# Altium schematic sheet IO_robot.SchDoc
size A0; Organization: Altium Limited; Address1: L3, 12a Rodborough Rd; Address2: Frenchs Forest; Address3: NSW; Address4: Australia 2086
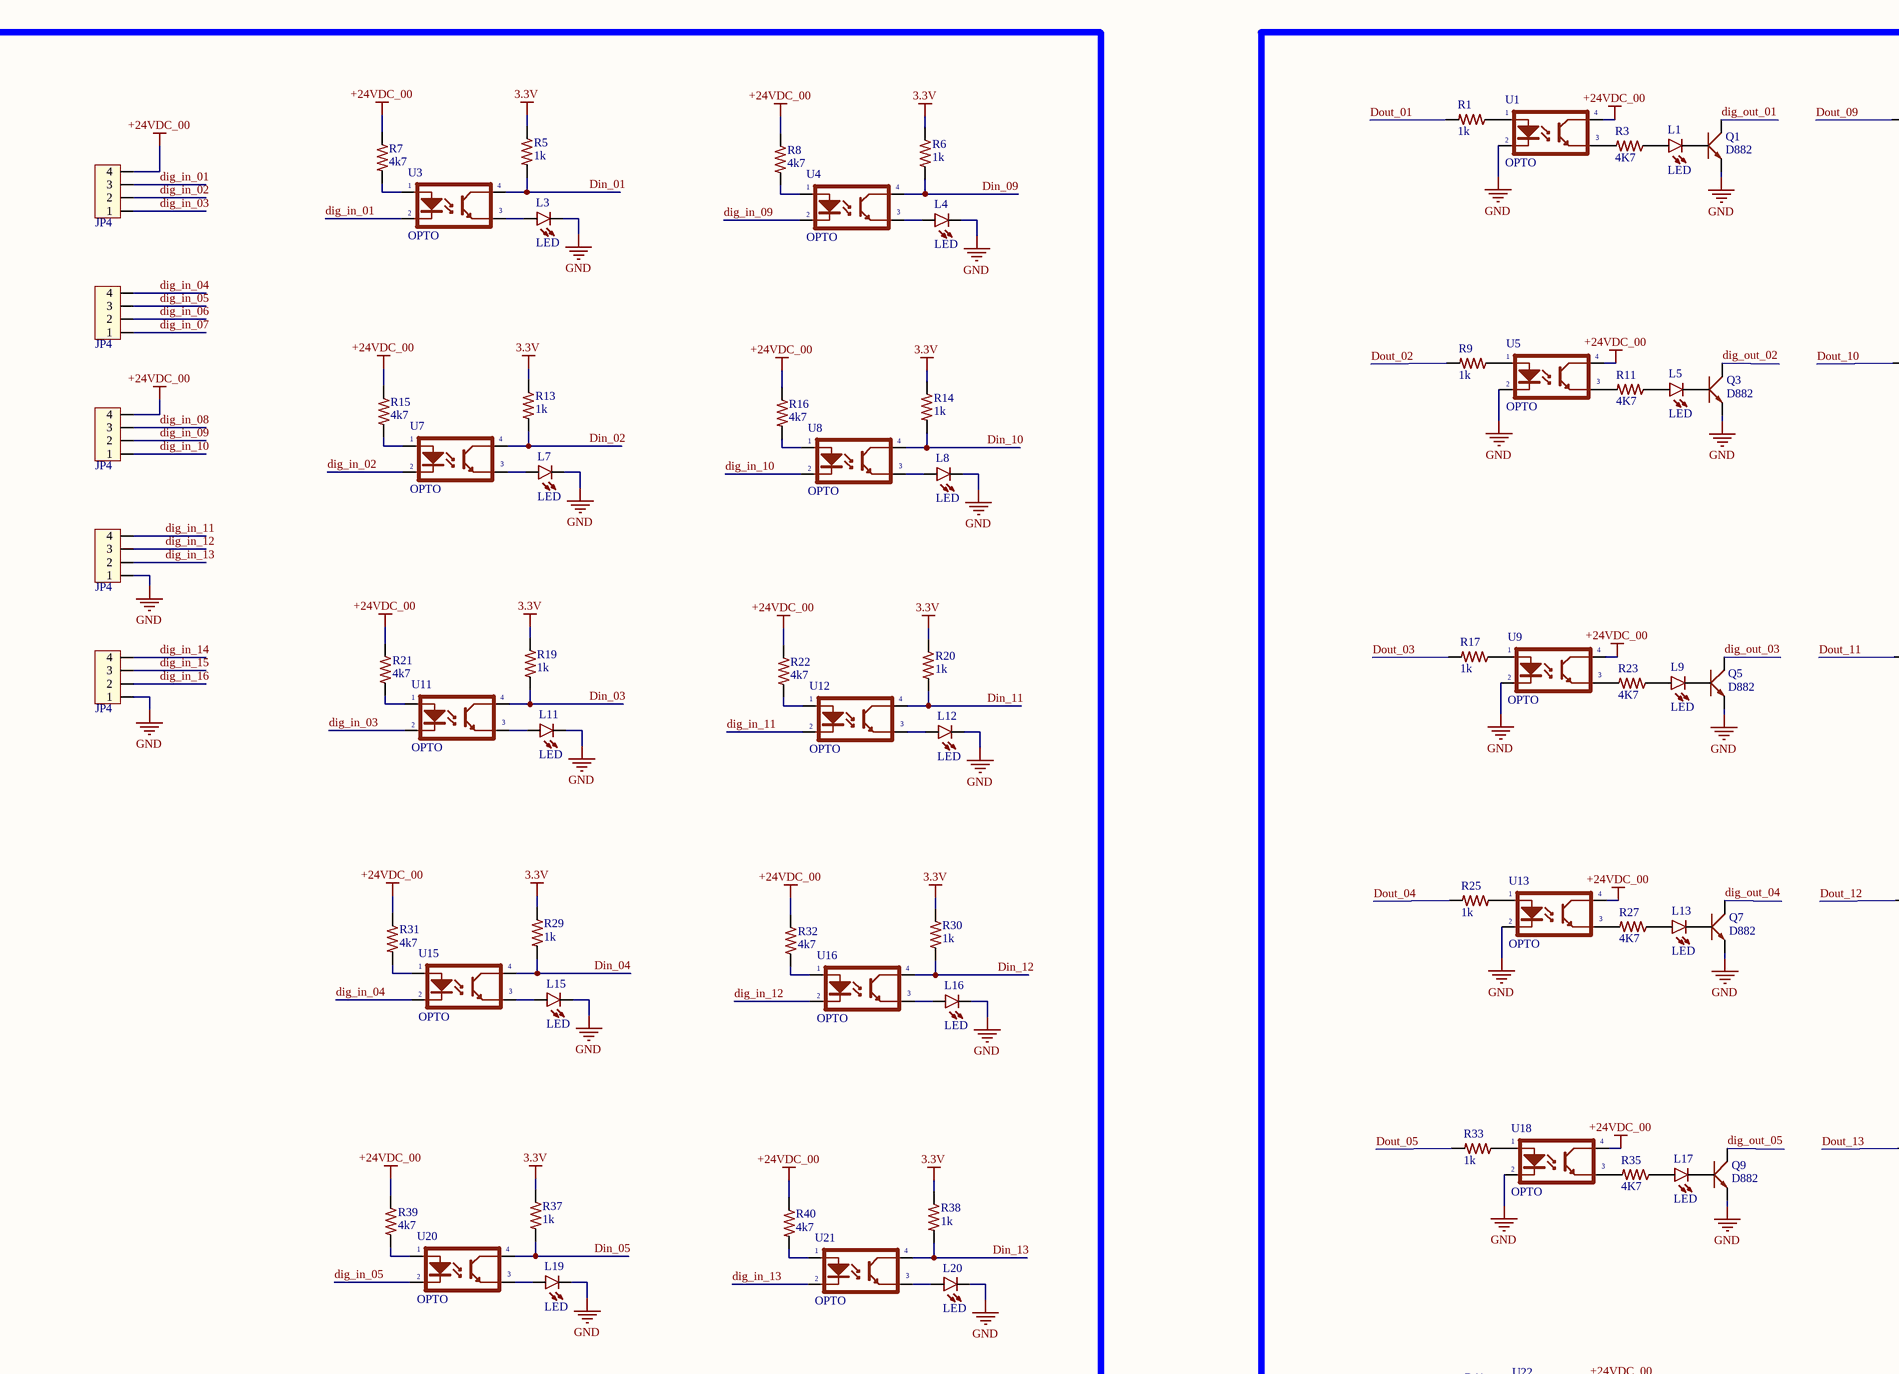
[diagram p0: IO_robot.SchDoc, top left]
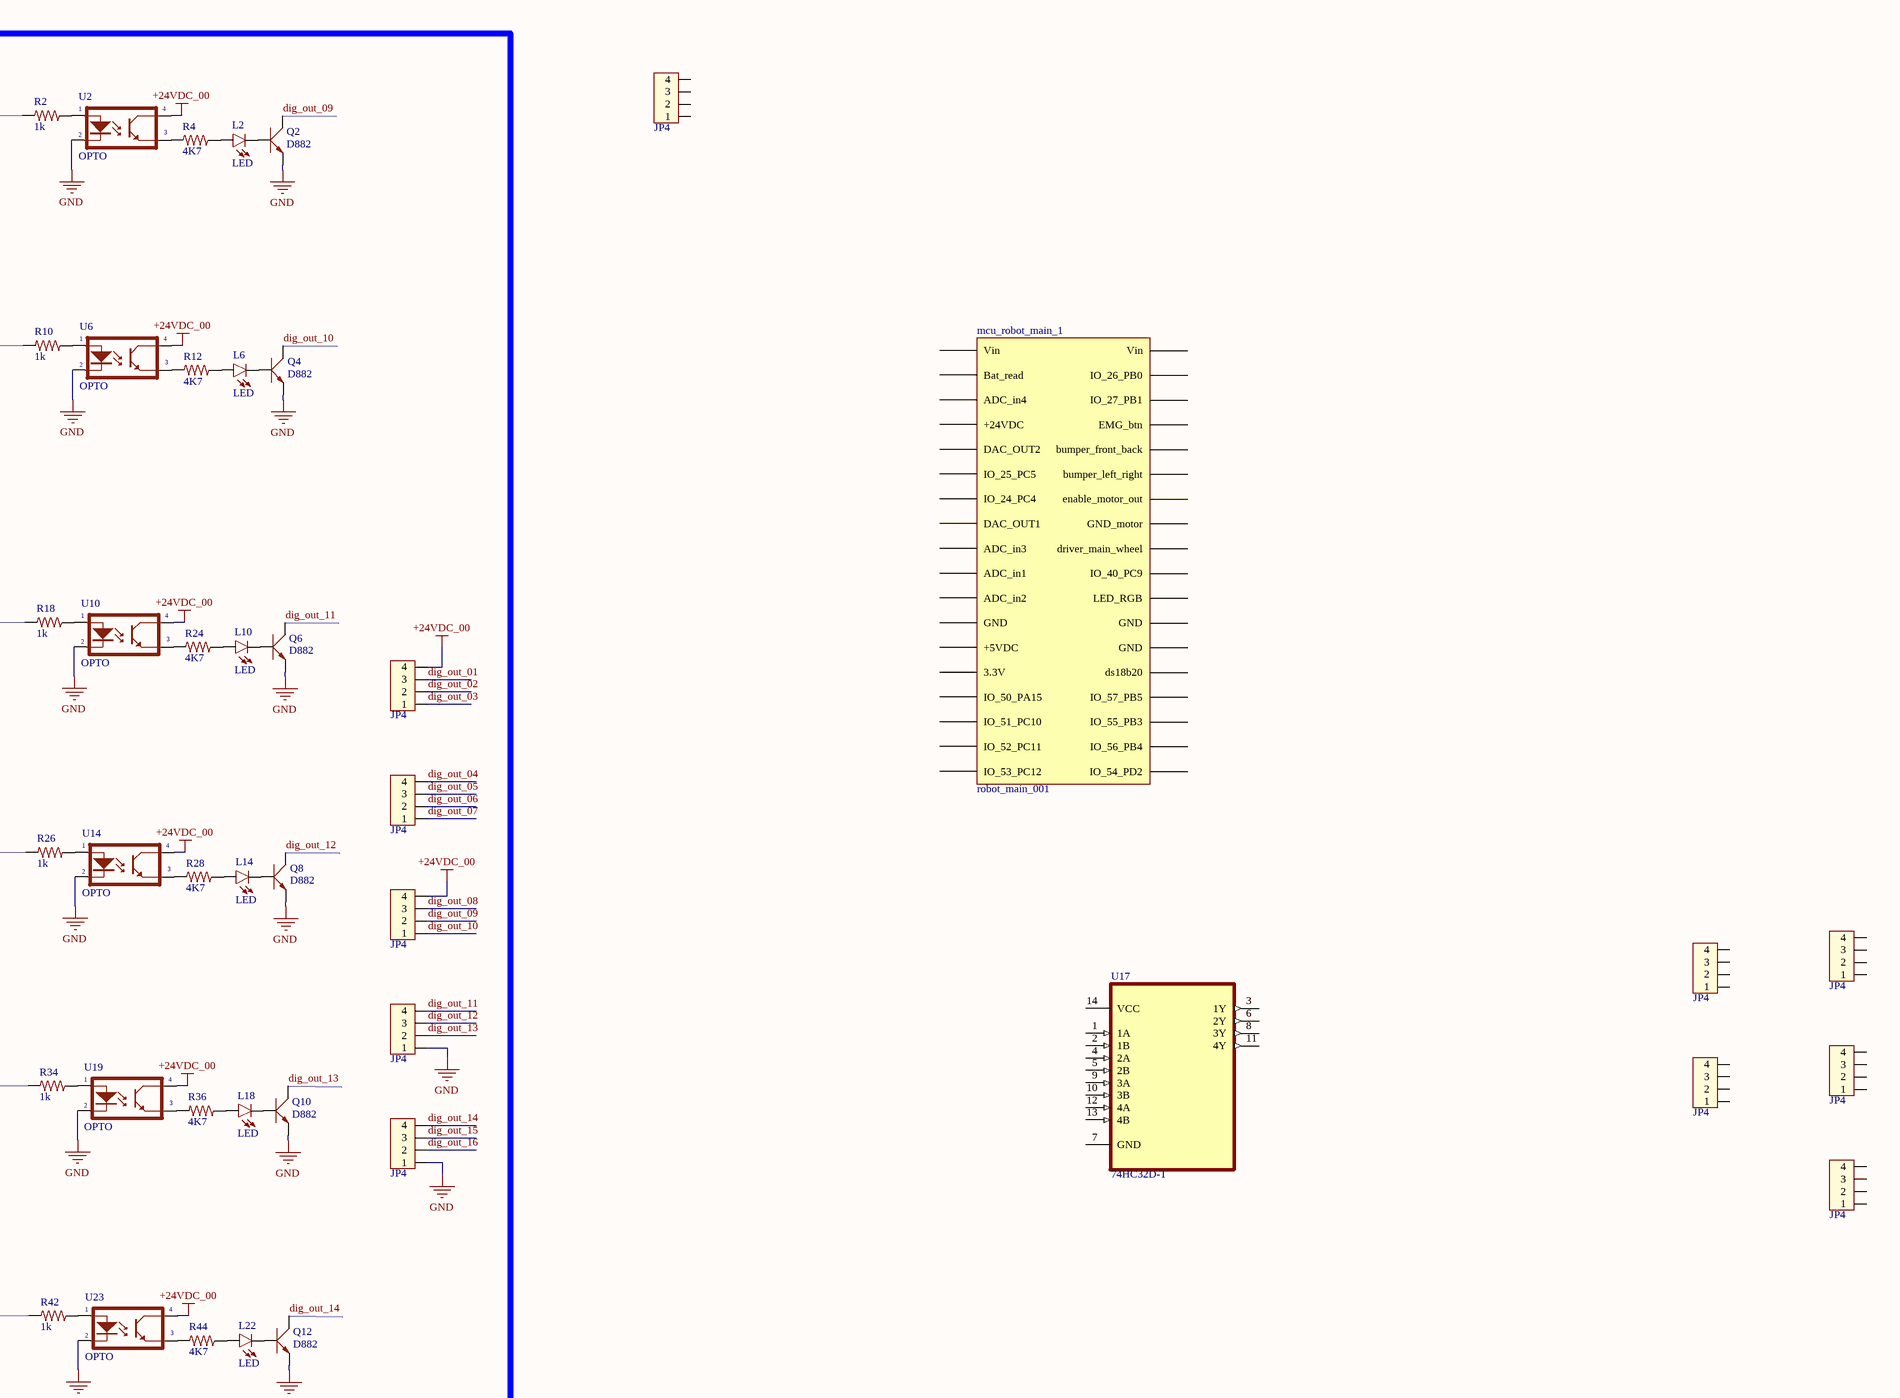
[diagram p1: IO_robot.SchDoc, top right]
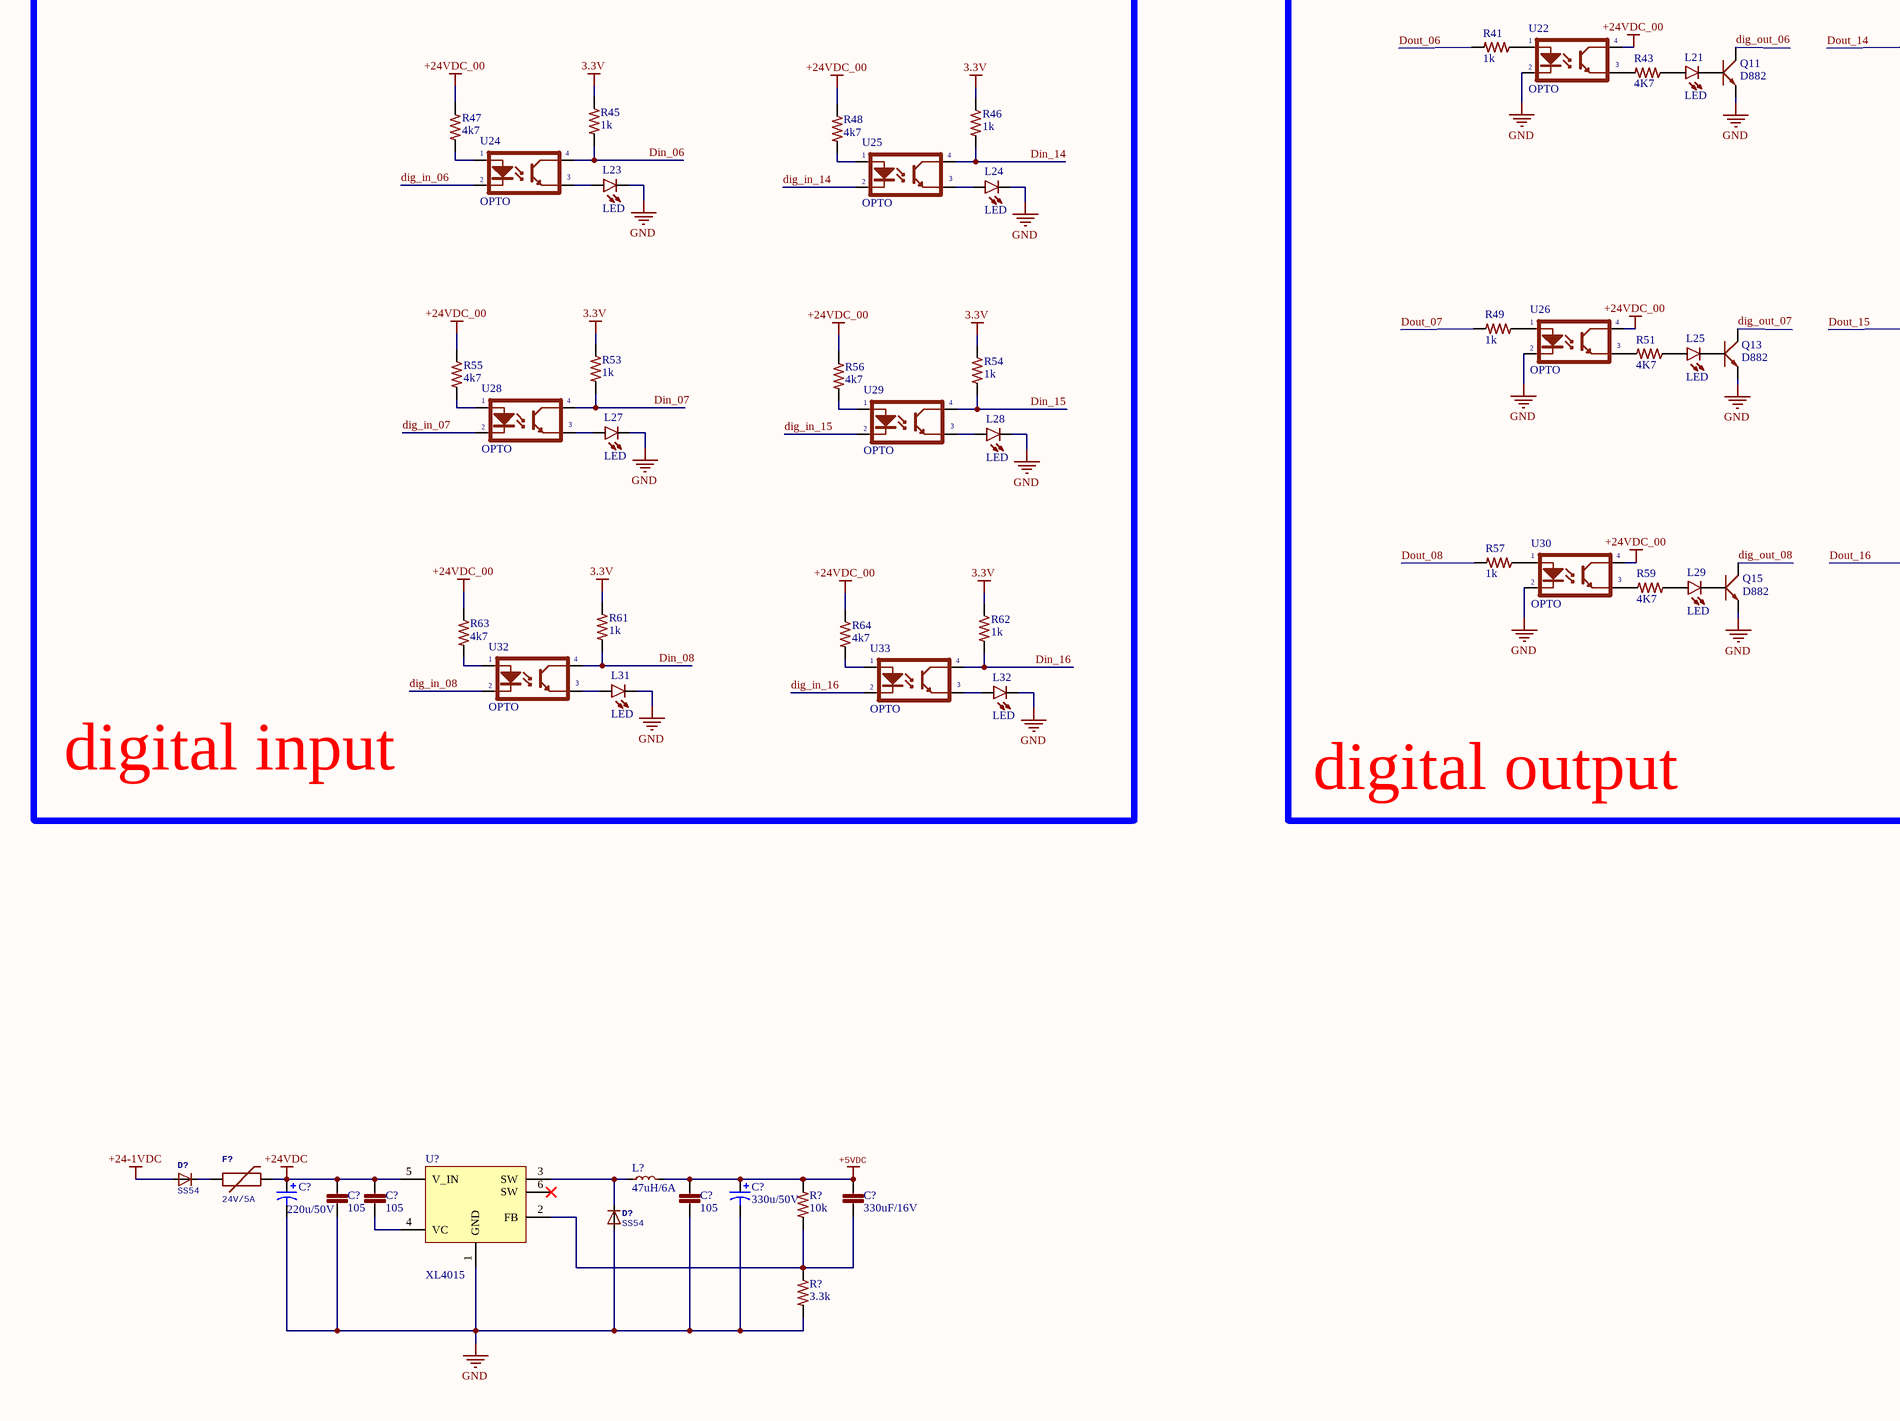
[diagram p2: IO_robot.SchDoc, bottom left]
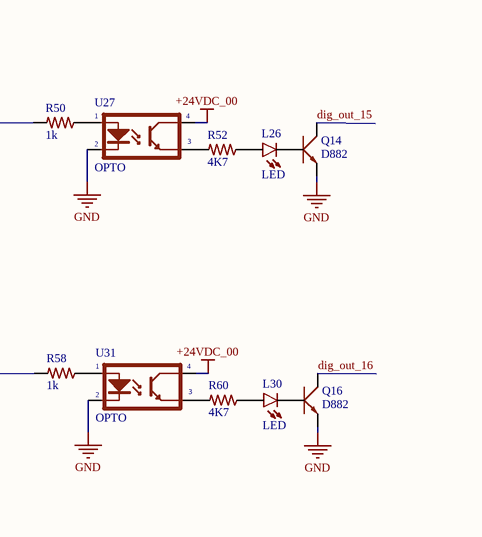
[diagram p3: IO_robot.SchDoc, bottom right]

## Parts
(Parts that share a designator on the sheet are numbered #1, #2 ... from top to bottom, then left to right.)
C?#1  220u/50V  [CAP_SMD_8x10]
C?#2  105  [CAP_SMD0603]
C?#3  105  [CAP_SMD0603]
C?#4  105  [CAP_SMD0603]
C?#5  330u/50V  [CAP_SMD_8x10]
C?#6  330uF/16V  [CAP_SMD0603]
D?#1  SS54  [SMB]
D?#2  SS54  [SMB]
F?  24V/5A  [1206]
JP1  JP4  [CON4]
JP2  JP4  [CON4]
JP3  JP4  [CON4]
JP4  JP4  [CON4]
JP5  JP4  [CON4]
JP6  JP4  [CON4]
JP7  JP4  [CON4]
JP8  JP4  [CON4]
JP9  JP4  [CON4]
JP10  JP4  [CON4]
JP11  JP4  [CON4]
JP12  JP4  [CON4]
JP13  JP4  [CON4]
JP14  JP4  [CON4]
JP15  JP4  [CON4]
JP16  JP4  [CON4]
L1  LED  [LED_GREEN_SMD_0603]
L2  LED  [LED_GREEN_SMD_0603]
L3  LED  [LED_RED_SMD_0603]
L4  LED  [LED_RED_SMD_0603]
L5  LED  [LED_GREEN_SMD_0603]
L6  LED  [LED_GREEN_SMD_0603]
L7  LED  [LED_RED_SMD_0603]
L8  LED  [LED_RED_SMD_0603]
L9  LED  [LED_GREEN_SMD_0603]
L10  LED  [LED_GREEN_SMD_0603]
L11  LED  [LED_RED_SMD_0603]
L12  LED  [LED_RED_SMD_0603]
L13  LED  [LED_GREEN_SMD_0603]
L14  LED  [LED_GREEN_SMD_0603]
L15  LED  [LED_RED_SMD_0603]
L16  LED  [LED_RED_SMD_0603]
L17  LED  [LED_GREEN_SMD_0603]
L18  LED  [LED_GREEN_SMD_0603]
L19  LED  [LED_RED_SMD_0603]
L20  LED  [LED_RED_SMD_0603]
L21  LED  [LED_GREEN_SMD_0603]
L22  LED  [LED_GREEN_SMD_0603]
L23  LED  [LED_RED_SMD_0603]
L24  LED  [LED_RED_SMD_0603]
L25  LED  [LED_GREEN_SMD_0603]
L26  LED  [LED_GREEN_SMD_0603]
L27  LED  [LED_RED_SMD_0603]
L28  LED  [LED_RED_SMD_0603]
L29  LED  [LED_GREEN_SMD_0603]
L30  LED  [LED_GREEN_SMD_0603]
L31  LED  [LED_RED_SMD_0603]
L32  LED  [LED_RED_SMD_0603]
L?  47uH/6A  [Inductor_47uH_6A]
mcu_robot_main_1  robot_main_001  [robot_main_001]
Q1  D882  [SOT89]
Q2  D882  [SOT89]
Q3  D882  [SOT89]
Q4  D882  [SOT89]
Q5  D882  [SOT89]
Q6  D882  [SOT89]
Q7  D882  [SOT89]
Q8  D882  [SOT89]
Q9  D882  [SOT89]
Q10  D882  [SOT89]
Q11  D882  [SOT89]
Q12  D882  [SOT89]
Q13  D882  [SOT89]
Q14  D882  [SOT89]
Q15  D882  [SOT89]
Q16  D882  [SOT89]
R1  1k  [RES_SMD0603]
R2  1k  [RES_SMD0603]
R3  4K7  [RES_SMD0603]
R4  4K7  [RES_SMD0603]
R5  1k  [RES_SMD0603]
R6  1k  [RES_SMD0603]
R7  4k7  [RES_SMD0603]
R8  4k7  [RES_SMD0603]
R9  1k  [RES_SMD0603]
R10  1k  [RES_SMD0603]
R11  4K7  [RES_SMD0603]
R12  4K7  [RES_SMD0603]
R13  1k  [RES_SMD0603]
R14  1k  [RES_SMD0603]
R15  4k7  [RES_SMD0603]
R16  4k7  [RES_SMD0603]
R17  1k  [RES_SMD0603]
R18  1k  [RES_SMD0603]
R19  1k  [RES_SMD0603]
R20  1k  [RES_SMD0603]
R21  4k7  [RES_SMD0603]
R22  4k7  [RES_SMD0603]
R23  4K7  [RES_SMD0603]
R24  4K7  [RES_SMD0603]
R25  1k  [RES_SMD0603]
R26  1k  [RES_SMD0603]
R27  4K7  [RES_SMD0603]
R28  4K7  [RES_SMD0603]
R29  1k  [RES_SMD0603]
R30  1k  [RES_SMD0603]
R31  4k7  [RES_SMD0603]
R32  4k7  [RES_SMD0603]
R33  1k  [RES_SMD0603]
R34  1k  [RES_SMD0603]
R35  4K7  [RES_SMD0603]
R36  4K7  [RES_SMD0603]
R37  1k  [RES_SMD0603]
R38  1k  [RES_SMD0603]
R39  4k7  [RES_SMD0603]
R40  4k7  [RES_SMD0603]
R41  1k  [RES_SMD0603]
R42  1k  [RES_SMD0603]
R43  4K7  [RES_SMD0603]
R44  4K7  [RES_SMD0603]
R45  1k  [RES_SMD0603]
R46  1k  [RES_SMD0603]
R47  4k7  [RES_SMD0603]
R48  4k7  [RES_SMD0603]
R49  1k  [RES_SMD0603]
R50  1k  [RES_SMD0603]
R51  4K7  [RES_SMD0603]
R52  4K7  [RES_SMD0603]
R53  1k  [RES_SMD0603]
R54  1k  [RES_SMD0603]
R55  4k7  [RES_SMD0603]
R56  4k7  [RES_SMD0603]
R57  1k  [RES_SMD0603]
R58  1k  [RES_SMD0603]
R59  4K7  [RES_SMD0603]
R60  4K7  [RES_SMD0603]
R61  1k  [RES_SMD0603]
R62  1k  [RES_SMD0603]
R63  4k7  [RES_SMD0603]
R64  4k7  [RES_SMD0603]
R?#1  10k  [RES_SMD0603]
R?#2  3.3k  [RES_SMD0603]
U1  OPTO  [SOP4]
U2  OPTO  [SOP4]
U3  OPTO  [SOP4]
U4  OPTO  [SOP4]
U5  OPTO  [SOP4]
U6  OPTO  [SOP4]
U7  OPTO  [SOP4]
U8  OPTO  [SOP4]
U9  OPTO  [SOP4]
U10  OPTO  [SOP4]
U11  OPTO  [SOP4]
U12  OPTO  [SOP4]
U13  OPTO  [SOP4]
U14  OPTO  [SOP4]
U15  OPTO  [SOP4]
U16  OPTO  [SOP4]
U17  74HC32D-T  [SOIC127P600X175-14N]
U18  OPTO  [SOP4]
U19  OPTO  [SOP4]
U20  OPTO  [SOP4]
U21  OPTO  [SOP4]
U22  OPTO  [SOP4]
U23  OPTO  [SOP4]
U24  OPTO  [SOP4]
U25  OPTO  [SOP4]
U26  OPTO  [SOP4]
U27  OPTO  [SOP4]
U28  OPTO  [SOP4]
U29  OPTO  [SOP4]
U30  OPTO  [SOP4]
U31  OPTO  [SOP4]
U32  OPTO  [SOP4]
U33  OPTO  [SOP4]
U?  XL4015  [TO-263-5]

## Nets
3.3V: R5.1 R6.1 R13.1 R14.1 R19.1 R20.1 R29.1 R30.1 R37.1 R38.1 R45.1 R46.1 R53.1 R54.1 R61.1 R62.1
+5VDC: C?#4.1 C?#5.1 C?#6.1 L?.2 R?#1.1
+24-1VDC: D?#1.1
+24VDC: C?#1.1 C?#2.1 C?#3.1 F?.2 U?.5(V_IN)
+24VDC_00: JP1.4 JP3.4 JP6.4 JP9.4 R7.1 R8.1 R15.1 R16.1 R21.1 R22.1 R31.1 R32.1 R39.1 R40.1 R47.1 R48.1 R55.1 R56.1 R63.1 R64.1 U1.4(C) U2.4(C) U5.4(C) U6.4(C) U9.4(C) U10.4(C) U13.4(C) U14.4(C) U18.4(C) U19.4(C) U22.4(C) U23.4(C) U26.4(C) U27.4(C) U30.4(C) U31.4(C)
GND: C?#1.2 C?#2.2 C?#4.2 C?#5.2 D?#2.1 JP4.1 JP5.1 JP12.1 JP15.1 L3.2(POS) L4.2(POS) L7.2(POS) L8.2(POS) L11.2(POS) L12.2(POS) L15.2(POS) L16.2(POS) L19.2(POS) L20.2(POS) L23.2(POS) L24.2(POS) L27.2(POS) L28.2(POS) L31.2(POS) L32.2(POS) Q1.2(EMITTER) Q2.2(EMITTER) Q3.2(EMITTER) Q4.2(EMITTER) Q5.2(EMITTER) Q6.2(EMITTER) Q7.2(EMITTER) Q8.2(EMITTER) Q9.2(EMITTER) Q10.2(EMITTER) Q11.2(EMITTER) Q12.2(EMITTER) Q13.2(EMITTER) Q14.2(EMITTER) Q15.2(EMITTER) Q16.2(EMITTER) R?#2.2 U1.2(K) U2.2(K) U5.2(K) U6.2(K) U9.2(K) U10.2(K) U13.2(K) U14.2(K) U18.2(K) U19.2(K) U22.2(K) U23.2(K) U26.2(K) U27.2(K) U30.2(K) U31.2(K) U?.1(GND)
dig_in_01: JP1.3 U3.2(K)
dig_in_02: JP1.2 U7.2(K)
dig_in_03: JP1.1 U11.2(K)
dig_in_04: JP2.4 U15.2(K)
dig_in_05: JP2.3 U20.2(K)
dig_in_06: JP2.2 U24.2(K)
dig_in_07: JP2.1 U28.2(K)
dig_in_08: JP3.3 U32.2(K)
dig_in_09: JP3.2 U4.2(K)
dig_in_10: JP3.1 U8.2(K)
dig_in_11: JP4.4 U12.2(K)
dig_in_12: JP4.3 U16.2(K)
dig_in_13: JP4.2 U21.2(K)
dig_in_14: JP5.4 U25.2(K)
dig_in_15: JP5.3 U29.2(K)
dig_in_16: JP5.2 U33.2(K)
dig_out_01: JP6.3 Q1.3(COLLECTOR)
dig_out_02: JP6.2 Q3.3(COLLECTOR)
dig_out_03: JP6.1 Q5.3(COLLECTOR)
dig_out_04: JP7.4 Q7.3(COLLECTOR)
dig_out_05: JP7.3 Q9.3(COLLECTOR)
dig_out_06: JP7.2 Q11.3(COLLECTOR)
dig_out_07: JP7.1 Q13.3(COLLECTOR)
dig_out_08: JP9.3 Q15.3(COLLECTOR)
dig_out_09: JP9.2 Q2.3(COLLECTOR)
dig_out_10: JP9.1 Q4.3(COLLECTOR)
dig_out_11: JP12.4 Q6.3(COLLECTOR)
dig_out_12: JP12.3 Q8.3(COLLECTOR)
dig_out_13: JP12.2 Q10.3(COLLECTOR)
dig_out_14: JP15.4 Q12.3(COLLECTOR)
dig_out_15: JP15.3 Q14.3(COLLECTOR)
dig_out_16: JP15.2 Q16.3(COLLECTOR)
Din_01: R5.2 U3.4(C)
Din_02: R13.2 U7.4(C)
Din_03: R19.2 U11.4(C)
Din_04: R29.2 U15.4(C)
Din_05: R37.2 U20.4(C)
Din_06: R45.2 U24.4(C)
Din_07: R53.2 U28.4(C)
Din_08: R61.2 U32.4(C)
Din_09: R6.2 U4.4(C)
Din_10: R14.2 U8.4(C)
Din_11: R20.2 U12.4(C)
Din_12: R30.2 U16.4(C)
Din_13: R38.2 U21.4(C)
Din_14: R46.2 U25.4(C)
Din_15: R54.2 U29.4(C)
Din_16: R62.2 U33.4(C)
Dout_01: R1.2
Dout_02: R9.2
Dout_03: R17.2
Dout_04: R25.2
Dout_05: R33.2
Dout_06: R41.2
Dout_07: R49.2
Dout_08: R57.2
Dout_09: R2.2
Dout_10: R10.2
Dout_11: R18.2
Dout_12: R26.2
Dout_13: R34.2
Dout_14: R42.2
Dout_15: R50.2
Dout_16: R58.2
NetC?#3_2: C?#3.2 U?.4(VC)
NetC?#6_2: C?#6.2 R?#1.2 R?#2.1 U?.2(FB)
NetD?#1_2: D?#1.2 F?.1
NetD?#2_2: D?#2.2 L?.1 U?.3(SW)
NetL1_1: L1.1(NEG) R3.1
NetL1_2: L1.2(POS) Q1.1(BASE)
NetL2_1: L2.1(NEG) R4.1
NetL2_2: L2.2(POS) Q2.1(BASE)
NetL3_1: L3.1(NEG) U3.3(E)
NetL4_1: L4.1(NEG) U4.3(E)
NetL5_1: L5.1(NEG) R11.1
NetL5_2: L5.2(POS) Q3.1(BASE)
NetL6_1: L6.1(NEG) R12.1
NetL6_2: L6.2(POS) Q4.1(BASE)
NetL7_1: L7.1(NEG) U7.3(E)
NetL8_1: L8.1(NEG) U8.3(E)
NetL9_1: L9.1(NEG) R23.1
NetL9_2: L9.2(POS) Q5.1(BASE)
NetL10_1: L10.1(NEG) R24.1
NetL10_2: L10.2(POS) Q6.1(BASE)
NetL11_1: L11.1(NEG) U11.3(E)
NetL12_1: L12.1(NEG) U12.3(E)
NetL13_1: L13.1(NEG) R27.1
NetL13_2: L13.2(POS) Q7.1(BASE)
NetL14_1: L14.1(NEG) R28.1
NetL14_2: L14.2(POS) Q8.1(BASE)
NetL15_1: L15.1(NEG) U15.3(E)
NetL16_1: L16.1(NEG) U16.3(E)
NetL17_1: L17.1(NEG) R35.1
NetL17_2: L17.2(POS) Q9.1(BASE)
NetL18_1: L18.1(NEG) R36.1
NetL18_2: L18.2(POS) Q10.1(BASE)
NetL19_1: L19.1(NEG) U20.3(E)
NetL20_1: L20.1(NEG) U21.3(E)
NetL21_1: L21.1(NEG) R43.1
NetL21_2: L21.2(POS) Q11.1(BASE)
NetL22_1: L22.1(NEG) R44.1
NetL22_2: L22.2(POS) Q12.1(BASE)
NetL23_1: L23.1(NEG) U24.3(E)
NetL24_1: L24.1(NEG) U25.3(E)
NetL25_1: L25.1(NEG) R51.1
NetL25_2: L25.2(POS) Q13.1(BASE)
NetL26_1: L26.1(NEG) R52.1
NetL26_2: L26.2(POS) Q14.1(BASE)
NetL27_1: L27.1(NEG) U28.3(E)
NetL28_1: L28.1(NEG) U29.3(E)
NetL29_1: L29.1(NEG) R59.1
NetL29_2: L29.2(POS) Q15.1(BASE)
NetL30_1: L30.1(NEG) R60.1
NetL30_2: L30.2(POS) Q16.1(BASE)
NetL31_1: L31.1(NEG) U32.3(E)
NetL32_1: L32.1(NEG) U33.3(E)
NetR1_1: R1.1 U1.1(A)
NetR2_1: R2.1 U2.1(A)
NetR3_2: R3.2 U1.3(E)
NetR4_2: R4.2 U2.3(E)
NetR7_2: R7.2 U3.1(A)
NetR8_2: R8.2 U4.1(A)
NetR9_1: R9.1 U5.1(A)
NetR10_1: R10.1 U6.1(A)
NetR11_2: R11.2 U5.3(E)
NetR12_2: R12.2 U6.3(E)
NetR15_2: R15.2 U7.1(A)
NetR16_2: R16.2 U8.1(A)
NetR17_1: R17.1 U9.1(A)
NetR18_1: R18.1 U10.1(A)
NetR21_2: R21.2 U11.1(A)
NetR22_2: R22.2 U12.1(A)
NetR23_2: R23.2 U9.3(E)
NetR24_2: R24.2 U10.3(E)
NetR25_1: R25.1 U13.1(A)
NetR26_1: R26.1 U14.1(A)
NetR27_2: R27.2 U13.3(E)
NetR28_2: R28.2 U14.3(E)
NetR31_2: R31.2 U15.1(A)
NetR32_2: R32.2 U16.1(A)
NetR33_1: R33.1 U18.1(A)
NetR34_1: R34.1 U19.1(A)
NetR35_2: R35.2 U18.3(E)
NetR36_2: R36.2 U19.3(E)
NetR39_2: R39.2 U20.1(A)
NetR40_2: R40.2 U21.1(A)
NetR41_1: R41.1 U22.1(A)
NetR42_1: R42.1 U23.1(A)
NetR43_2: R43.2 U22.3(E)
NetR44_2: R44.2 U23.3(E)
NetR47_2: R47.2 U24.1(A)
NetR48_2: R48.2 U25.1(A)
NetR49_1: R49.1 U26.1(A)
NetR50_1: R50.1 U27.1(A)
NetR51_2: R51.2 U26.3(E)
NetR52_2: R52.2 U27.3(E)
NetR55_2: R55.2 U28.1(A)
NetR56_2: R56.2 U29.1(A)
NetR57_1: R57.1 U30.1(A)
NetR58_1: R58.1 U31.1(A)
NetR59_2: R59.2 U30.3(E)
NetR60_2: R60.2 U31.3(E)
NetR63_2: R63.2 U32.1(A)
NetR64_2: R64.2 U33.1(A)

Not connected (* = marked no-connect by the designer): JP8 1 2 3 4; JP10 1 2 3 4; JP11 1 2 3 4; JP13 1 2 3 4; JP14 1 2 3 4; JP16 1 2 3 4; mcu_robot_main_1 1(Vin) 2(Bat_read) 3(ADC_in4) 4(+24VDC) 5(DAC_OUT2) 6(IO_25_PC5) 7(IO_24_PC4) 8(DAC_OUT1) 9(ADC_in3) 10(ADC_in1) 11(ADC_in2) 12(GND) 13(+5VDC) 14(3.3V) 15(IO_50_PA15) 16(IO_51_PC10) 17(IO_52_PC11) 18(IO_53_PC12) 19(IO_54_PD2) 20(IO_56_PB4) 21(IO_55_PB3) 22(IO_57_PB5) 23(ds18b20) 24(GND) 25(GND) 26(LED_RGB) 27(IO_40_PC9) 28(driver_main_wheel) 29(GND_motor) 30(enable_motor_out) 31(bumper_left_right) 32(bumper_front_back) 33(EMG_btn) 34(IO_27_PB1) 35(IO_26_PB0) 36(Vin); U17 1(1A) 2(1B) 3(1Y) 4(2A) 5(2B) 6(2Y) 7(GND) 8(3Y) 9(3A) 10(3B) 11(4Y) 12(4A) 13(4B) 14(VCC); U? 6(SW)*

## Notes on the sheet
- Labels drawn without touching a wire or pin: digital input, digital output
- Designer
- Name
- Date
- Sign
- Checker
- Address:
- TEL:
- Website:
- Drawing:
- Size:
- A3
- Sheet:
- /
- Code:

## Library data of the parts
C?#1 C?#5 = Cap_Pol
C?#2-C?#4 C?#6 = Cap
D?#1 D?#2 = DIODE
F? = Fuse
JP1-JP16 = Con4: Connector 4; Value: Connector 4
L1-L32 = LED: Lighting Eminter Diode
L? = Inductors
mcu_robot_main_1 = robot_main_001: stm32f4_mpu9250
Q1-Q16 = Tranzitor NPN: pin to pad: 2>3 3>2
R1-R64 R?#1 R?#2 = Resistor
U17 = 74HC32D-T: OR Gate IC 4 Channel 14-SO; MF: Nexperia USA; Availability: Unavailable; SnapEDA_Link: https://www.snapeda.com/parts/74HC32D-T/Nexperia%20USA%20Inc./view-part/398122/?ref=snap; Value: *; Price: None; Package: SOIC-14 NXP Semiconductors; MP: 74HC32D-T